# EasyEDA schematic SmartLamp_2020-11-09_21-14-12.json
TITLE: SmartLamp; REV: 1.0; Date: 2020-11-09; Sheet: 1/1; Drawn By: Danisimo; Company: Your Company
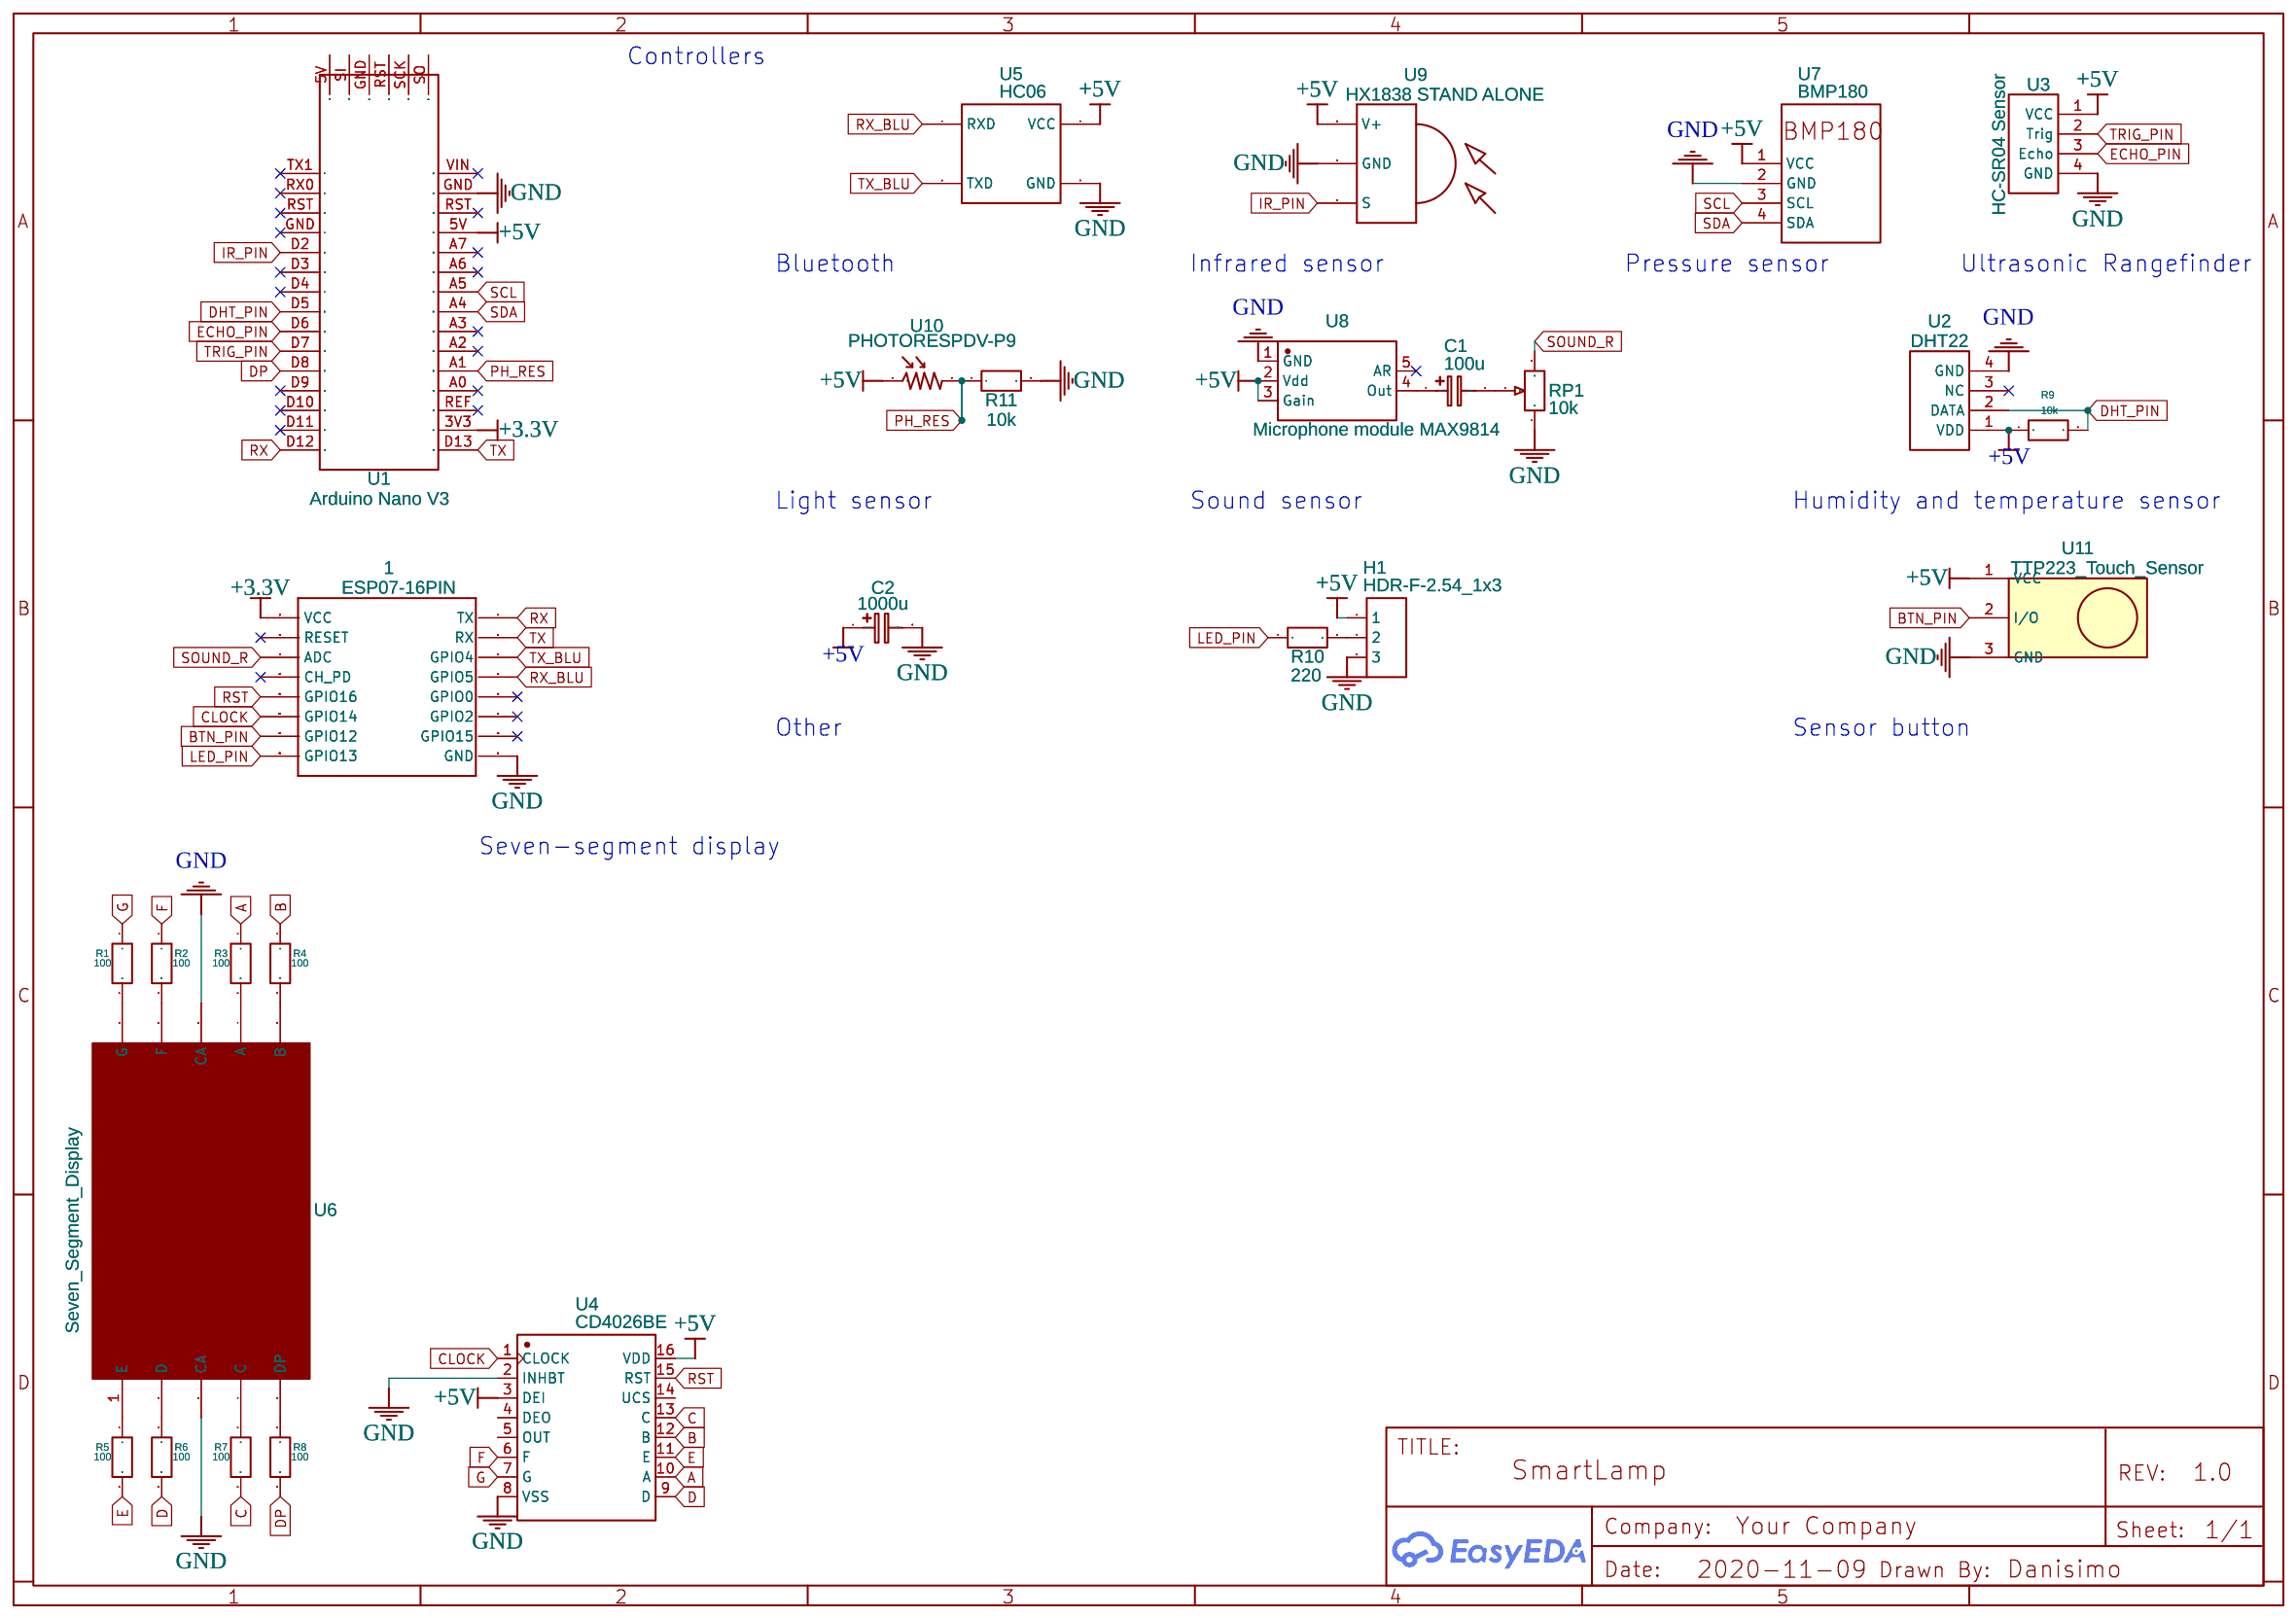
[diagram p0: schematic sheet]

## Parts
1  ESP07-16PIN  [ESP07]
C1  100u  [CASE-A_3216]
C2  1000u  [CASE-A_3216]
H1  HDR-F-2.54_1x3  [HDR-F-2.54_1X3]
R1  100  [R0603]
R2  100  [R0603]
R3  100  [R0603]
R4  100  [R0603]
R5  100  [R0603]
R6  100  [R0603]
R7  100  [R0603]
R8  100  [R0603]
R9  10k  [R0603]
R10  220  [R0603]
R11  10k  [R0603]
RP1  10k  [RES-ADJ-TH_3386P]
U1  Arduino Nano V3  [ARDUINO NANO V3]
U2  DHT22  [DHT22_AM2303_VERT]
U3  HC-SR04 Sensor  [MY HC-SR04]
U4  CD4026BE  [DIP-16]
U5  HC06  [BLUETOOTH_HC-06]
U6  Seven_Segment_Display
U7  BMP180  [BMP180_NICKS]
U8  Microphone module MAX9814  [MICROPHONE MODULE MAX9814]
U9  HX1838 STAND ALONE  [HX1838 STAND ALONE]
U10  PHOTORESPDV-P9  [PDV-P9XXX]
U11  TTP223_Touch_Sensor  [TTP223_TOUCH_MODULE_DOC]

## Library data of the parts
1 = ESP07-16PIN: Contributor: moudjibou
C1 C2 = C_Tan_SMD_A_EU: Contributor: LCEDA_Lib
H1 = HDR-F-2.54_1x3: Supplier Part: C146690; Supplier: LCSC; Contributor: LCEDA_Lib
R1-R11 = R_0603_EU: Contributor: LCEDA_Lib
RP1 = R_3386P_EU: Supplier: LCSC; Contributor: LCEDA_Lib; Value(Ω): 10K
U1 = Arduino Nano V3: Contributor: rampage-128
U2 = DHT22
U3 = My HC-SR04 Sensor: Manufacturer Part: Pin_Header_4P; Contributor: Mohammed Al-shatti
U4 = CD4026BE: Supplier: LCSC; Manufacturer: TI; Supplier Part: C89909; Contributor: vkomendyak
U5 = HC06: Contributor: h6000p
U6 = Seven_Segment_Display: Contributor: Saroja patil
U7 = BMP180_NICKS: Contributor: ndamo
U8 = Microphone module MAX9814: Contributor: Eleonora
U9 = HX1838 STAND ALONE: Contributor: kleanair
U10 = PHOTORESPDV-P9: Contributor: Jose Andres Murillo Duran
U11 = TTP223_Touch_Sensor: Manufacturer Part: TTP223 BREAKOUT; Contributor: Muhammad Younus

## Nets
+3.3V: 1.VCC U1.3V3(17)
+5V: C2.1 H1.1 R9.1 U1.5V(36) U2.1(VDD) U3.1(VCC) U4.3(DEI) U4.16(VDD) U5.1(VCC) U7.1(VCC) U8.2(Vdd) U8.3(Gain) U9.VCC(V+) U10.1 U11.1(VCC)
GND: 1.GND C2.2 H1.3 R11.2 RP1.1 U1.GND(34) U2.4(GND) U3.4(GND) U4.2(INHBT) U4.8(VSS) U5.2(GND) U6.3(CA) U6.8(CA) U7.2(GND) U8.1(GND) U9.GND U11.3(GND)
A: R3.1 U4.10(A)
B: R4.1 U4.12(B)
BTN_PIN: 1.GPIO12 U11.2(I/O)
C: R7.2 U4.13(C)
CLOCK: 1.GPIO14 U4.1(CLOCK)
D: R6.2 U4.9(D)
DHT_PIN: R9.2 U1.D5(8) U2.2(DATA)
DP: R8.2 U1.D8(11)
E: R5.2 U4.11(E)
ECHO_PIN: U1.D6(9) U3.3(Echo)
F: R2.1 U4.6(F)
G: R1.1 U4.7(G)
IR_PIN: U1.D2(5) U9.S
LED_PIN: 1.GPIO13 R10.1
PH_RES: R11.1 U1.A1(20) U10.2
RST: 1.GPIO16 U4.15(RST)
RX: 1.TX U1.D12(15)
RX_BLU: 1.GPIO5 U5.4(RXD)
SCL: U1.A5(24) U7.3(SCL)
SDA: U1.A4(23) U7.4(SDA)
SOUND_R: 1.ADC RP1.3
TRIG_PIN: U1.D7 U3.2(Trig)
TX: 1.RX U1.D13(16)
TX_BLU: 1.GPIO4 U5.3(TXD)
Net-(C1-1): C1.1 U8.4(Out)
Net-(C1-2): C1.2 RP1.2
Net-(H1-2): H1.2 R10.2
Net-(R1-2): R1.2 U6.10(G)
Net-(R2-2): R2.2 U6.9(F)
Net-(R3-2): R3.2 U6.7(A)
Net-(R4-2): R4.2 U6.6(B)
Net-(R5-1): R5.1 U6.1(E)
Net-(R6-1): R6.1 U6.2(D)
Net-(R7-1): R7.1 U6.4(C)
Net-(R8-1): R8.1 U6.5(DP)

Not connected (* = marked no-connect by the designer): 1 CH_PD* GPIO0* GPIO2* GPIO15* REST(RESET)*; U1 A0(19)* A2(21)* A3(22)* A6(25)* A7(26)* D3(6)* D4(7)* D9(12)* D10(13)* D11(14)* REF(18)* RST(33)* RX0(2)* SCK(32) SI(35) SO(31) TX1(1)* VIN(30)*; U2 3(NC)*; U4 4(DEO) 5(OUT) 14(UCS); U8 5(AR)*

## Notes on the sheet
- Controllers
- Bluetooth
- Infrared sensor
- Pressure sensor
- Ultrasonic Rangefinder
- Light sensor
- Sound sensor
- Humidity and temperature sensor
- Other
- Sensor button
- Seven-segment display
